# Altium schematic sheet JTAG_connector3.SchDoc
size A
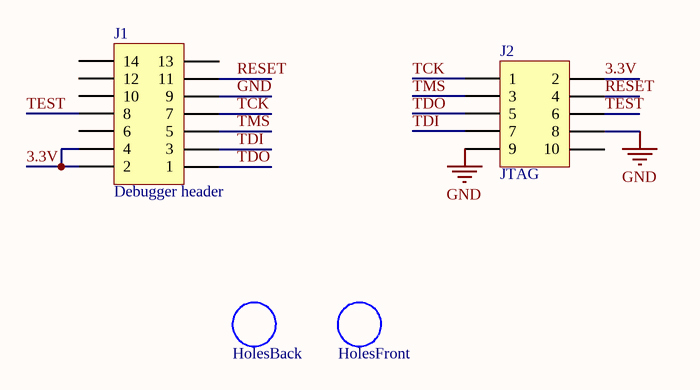
[diagram p0: JTAG_connector3.SchDoc]

## Parts
HolesBack  non connect  [3/8"Caster]  (value not drawn)
HolesFront  non connect  [3/8"Caster]  (value not drawn)
J1  Debugger header  [HDR2X7]
J2  JTAG  [HDR2X5]

## Nets
GND: J1.9 J2.8 J2.9
3.3V: J1.2 J1.4 J2.2
RESET: J1.11 J2.4
TCK: J1.7 J2.1
TDI: J1.3 J2.7
TDO: J1.1 J2.5
TEST: J1.8 J2.6
TMS: J1.5 J2.3

Not connected (* = marked no-connect by the designer): J1 6 10 12 13 14; J2 10

## Library data of the parts
HolesBack HolesFront = Caster: This is just a space saver to get the caster onto the pcb
J1 = Header 7X2: Header, 7-Pin, Dual row; LatestRevisionDate: 17-Jul-2002; LatestRevisionNote: Re-released for DXP Platform.; Publisher: Altium Limited
J2 = Header 5X2: Header, 5-Pin, Dual row; LatestRevisionDate: 17-Jul-2002; LatestRevisionNote: Re-released for DXP Platform.; Publisher: Altium Limited